# Altium schematic sheet WiFi_Module.SchDoc: WiFi Module
size A4
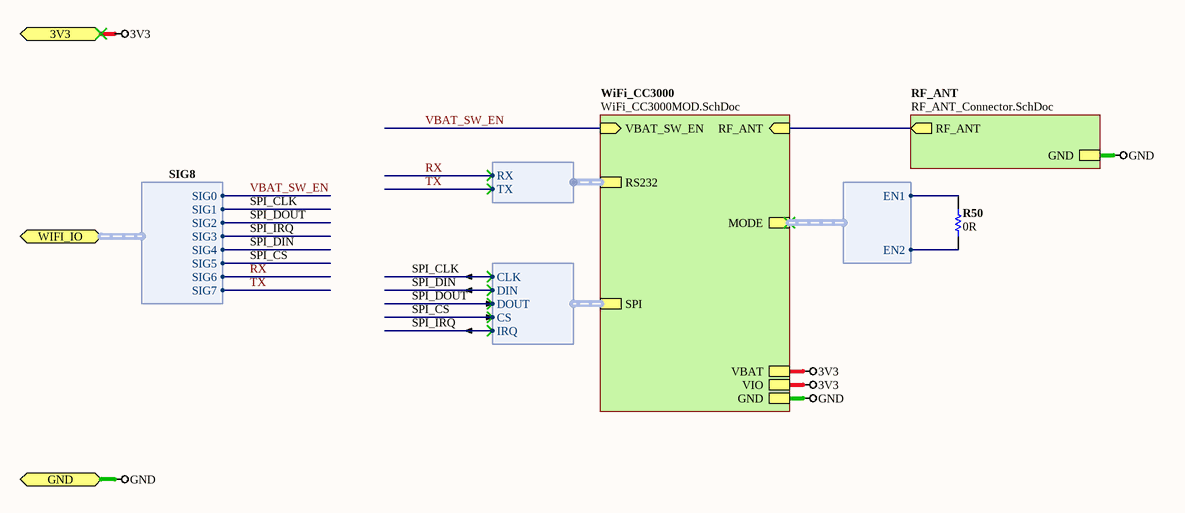
[diagram p0: WiFi_Module.SchDoc]

## Parts
R50  0R  [RESC0402(1005)_N]

## Sub-sheets
RF_ANT = RF_ANT_Connector.SchDoc: RF_ANT (out), GND
WiFi_CC3000 = WiFi_CC3000MOD.SchDoc: GND, VBAT, RS232 (harness RS232), SPI (harness SPI_CC3000), VBAT_SW_EN (in), RF_ANT (in), VIO, MODE (harness MODE_CC3000)

## Ports
3V3, GND, WIFI_IO (harness SIG8)

## Harnesses
RS232: RX, TX
SPI_CC3000: CLK, DIN, DOUT, CS, IRQ
SIG8: SIG0, SIG1, SIG2, SIG3, SIG4, SIG5, SIG6, SIG7
MODE_CC3000: EN1, EN2

## Nets
3V3: port 3V3, sheet WiFi_CC3000/VBAT, sheet WiFi_CC3000/VIO
GND: port GND, sheet WiFi_CC3000/GND, sheet RF_ANT/GND
RX: sheet WiFi_CC3000/RS232.RX, port WIFI_IO.SIG6
SPI_CLK: sheet WiFi_CC3000/SPI.CLK, port WIFI_IO.SIG1
SPI_CS: sheet WiFi_CC3000/SPI.CS, port WIFI_IO.SIG5
SPI_DIN: sheet WiFi_CC3000/SPI.DIN, port WIFI_IO.SIG4
SPI_DOUT: sheet WiFi_CC3000/SPI.DOUT, port WIFI_IO.SIG2
SPI_IRQ: sheet WiFi_CC3000/SPI.IRQ, port WIFI_IO.SIG3
TX: sheet WiFi_CC3000/RS232.TX, port WIFI_IO.SIG7
VBAT_SW_EN: sheet WiFi_CC3000/VBAT_SW_EN, port WIFI_IO.SIG0
NetR50_1: R50.1 ; sheet WiFi_CC3000/MODE.EN2
NetR50_2: R50.2 ; sheet WiFi_CC3000/MODE.EN1
(unnamed): sheet WiFi_CC3000/RF_ANT, sheet RF_ANT/RF_ANT

## Notes on the sheet
- Sheet Title
- Project Title
- Size:
- Date:
- A4
- Item:
- Time:
- Revision:
- Sheet
- of
- File:

## Library data of the parts
R50 = CMP-1011-00001-1: Jumper 0402 (1005 Metric); Tolerance: None; Case-Metric: 1005; Case-EIA: 0402; Value: 0.00 Ohm; Power: None; Technology: SMT